# Altium schematic sheet Relay Control.SchDoc: FER_TEMPLATE
size A4; Author: Leon Baždar; CompanyName: FER; Address1: Zagreb; SheetNumber: 6; SheetTotal: 7
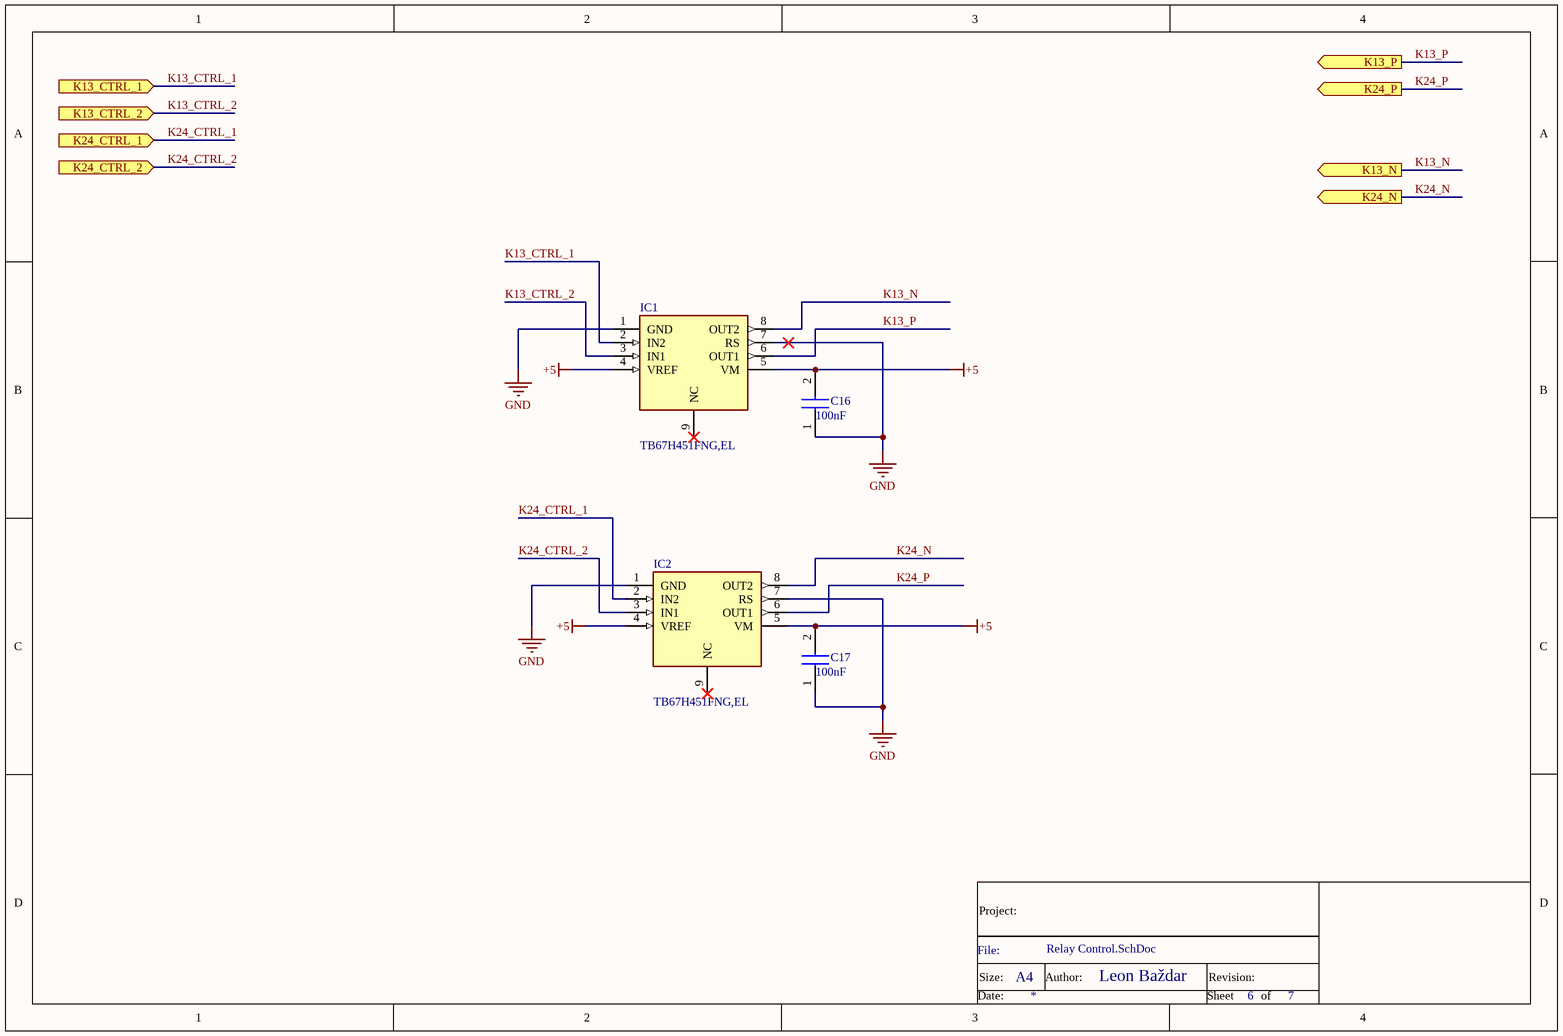
[diagram p0: Relay Control.SchDoc]

## Parts
C16  100nF  [CAPC1005X55N]
C17  100nF  [CAPC1005X55N]
IC1  TB67H451FNG,EL  [SOIC127P600X170-9N]
IC2  TB67H451FNG,EL  [SOIC127P600X170-9N]

## Ports
K13_CTRL_1 (in), K13_CTRL_2 (in), K13_N (out), K13_P (out), K24_CTRL_1 (in), K24_CTRL_2 (in), K24_N (out), K24_P (out)

## Nets
+5: C16.2 C17.2 IC1.4(VREF) IC1.5(VM) IC2.4(VREF) IC2.5(VM)
GND: C16.1 C17.1 IC1.1(GND) IC1.7(RS) IC2.1(GND) IC2.7(RS)
K13_CTRL_1: IC1.2(IN2) ; port K13_CTRL_1
K13_CTRL_2: IC1.3(IN1) ; port K13_CTRL_2
K13_N: IC1.8(OUT2) ; port K13_N
K13_P: IC1.6(OUT1) ; port K13_P
K24_CTRL_1: IC2.2(IN2) ; port K24_CTRL_1
K24_CTRL_2: IC2.3(IN1) ; port K24_CTRL_2
K24_N: IC2.8(OUT2) ; port K24_N
K24_P: IC2.6(OUT1) ; port K24_P

Not connected (* = marked no-connect by the designer): IC1 9(NC)*; IC2 9(NC)*

## Notes on the sheet
- Project:
- File:
- Size:
- A4
- Author:
- Revision:
- Date:
- Sheet
- of

## Library data of the parts
C16 C17 = GCM155L81E104KE02D: Capacitor; Manufacturer_Name: Murata Electronics; Datasheet Link: https://psearch.en.murata.com/capacitor/product/GCM155L81E104KE02%23.html; Height: 0.55mm; Manufacturer_Part_Number: GCM155L81E104KE02D
IC1 IC2 = TB67H451FNG,EL: Integrated Circuit; Manufacturer_Name: Toshiba; Datasheet Link: https://www.mouser.it/datasheet/2/408/TB67H451FNG_datasheet_en_20191111-1713881.pdf; Height: 1.7mm; Manufacturer_Part_Number: TB67H451FNG,EL